# Altium schematic sheet BTL.SchDoc
size A; SheetNumber: 1; SheetTotal: 1
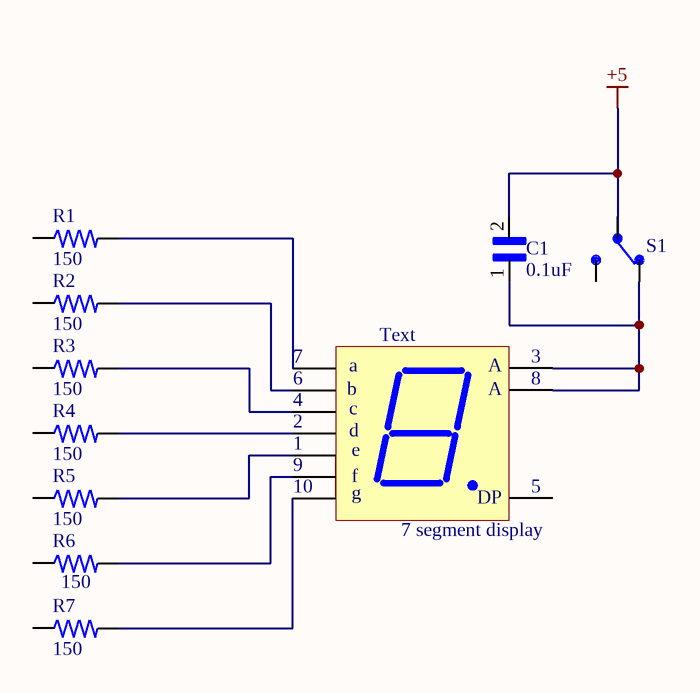
[diagram p0: BTL.SchDoc]

## Parts
?  (no value)  [DISPLAY_VDMG10A0]
C1  0.1uF  [CAPC1005X55N]
R1  150  [RESC2012X65N]
R2  150  [RESC2012X65N]
R3  150  [RESC2012X65N]
R4  150  [RESC2012X65N]
R5  150  [RESC2012X65N]
R6  150  [RESC2012X65N]
R7  150  [RESC2012X65N]
S1  JS102011JCQN  [SW_JS102011JCQN]  (value not drawn)

## Nets
+5: C1.2 S1.2
NetC1_1: C1.1 S1.1

Not connected (* = marked no-connect by the designer): ? ?1 ?2 ?3 ?4 ?5 ?6 ?7 ?8 ?9 ?10; R1 1 2; R2 1 2; R3 1 2; R4 1 2; R5 1 2; R6 1 2; R7 1 2; S1 3

## Notes on the sheet
- Text
- (in symbol Led 7S SMD) 7; 3; a; A; 6; 8; b; 4; c; 2; d; e; 9; f; 5; g; DP; 7 segment display

## Library data of the parts
? = Led 7S SMD: VDMG10 Series Green 7-Segment 572 nm SMT Display 10 mm Common Anode; Manufacturer: Vishay Semiconductors; Manufacturer Part Number: VDMG10A0; Wavelength: 572nm; Forward Current: 20mA; Forward Voltage: 2V; Power Consumption: 70mW; Number of Characters: 1; Luminous Intensity: 0.4mcd; Viewing Area (height): 10mm; Supplier 1: Digi-Key; RoHS: Yes; Category: LED Displays; Pricing 1: 1=1.55000, 10=1.38200, 100=1.07760 (USD); Case/Package: SMD/SMT; Number of Pins: 10; Color: Green; Min Operating Temperature: -35°C; Max Operating Temperature: 105°C; Illumination Color: Green; Element Configuration: Common Anode; Packaging: Tape and Reel; Package Quantity: 1; Max Power Dissipation: 70mW; Test Current: 20mA; Dominant Wavelength: 572nm; Width: 0.386inch; Height: 0.512inch; Radiation Hardening: No; REACH SVHC: Unknown; Lead Free: Lead Free; RoHS Compliant: Yes; ComponentLink1URL: https://datasheet.ciiva.com/23867/vdmx10x0-23867376.pdf?src-supplier=Newark; ComponentLink1Description: https://datasheet.ciiva.com/23867/vdmx10x0-23867376.pdf?src-supplier=Newark; ComponentLink2URL: https://datasheet.ciiva.com/24075/vdmx10x0-272413-24075313.pdf?src-supplier=Mouser; ComponentLink2Description: https://datasheet.ciiva.com/24075/vdmx10x0-272413-24075313.pdf?src-supplier=Mouser; ComponentLink3URL: https://datasheet.ciiva.com/23867/1809851-23867367.pdf?src-supplier=Newark; ComponentLink3Description: https://datasheet.ciiva.com/23867/1809851-23867367.pdf?src-supplier=Newark; ComponentLink4URL: https://datasheet.ciiva.com/29566/vdmx10x0-29566054.pdf?src-supplier=Digi-Key; ComponentLink4Description: https://datasheet.ciiva.com/29566/vdmx10x0-29566054.pdf?src-supplier=Digi-Key; ComponentLink5URL: https://datasheet.ciiva.com/29566/vdmx10x0-29566055.pdf?src-supplier=Digi-Key; ComponentLink5Description: https://datasheet.ciiva.com/29566/vdmx10x0-29566055.pdf?src-supplier=Digi-Key; ComponentLink6URL: https://datasheet.ciiva.com/24208/vdmx10x0-24208888.pdf?src-supplier=Future+Electronics; ComponentLink6Description: https://datasheet.ciiva.com/24208/vdmx10x0-24208888.pdf?src-supplier=Future+Electronics; ComponentLink7URL: https://datasheet.ciiva.com/29566/vdmx10x0-29566056.pdf?src-supplier=Digi-Key; ComponentLink7Description: https://datasheet.ciiva.com/29566/vdmx10x0-29566056.pdf?src-supplier=Digi-Key; ComponentLink8URL: https://datasheet.ciiva.com/30017/vdmx10x0-30017276.pdf?src-supplier=Avnet; ComponentLink8Description: https://datasheet.ciiva.com/30017/vdmx10x0-30017276.pdf?src-supplier=Avnet; ComponentLink9URL: https://datasheet.ciiva.com/22726/1913356-22726255.pdf?src-supplier=Element14; ComponentLink9Description: https://datasheet.ciiva.com/22726/1913356-22726255.pdf?src-supplier=Element14; Supplier Part Number 1: VDMG10A0DKR-ND
C1 = C0402C103K8RALTU: Cap Ceramic 0.01uF 10V X7R 10% SMD 0402 Paper T/R; Package: None; Price: None; Value: *; MP: C0402C103K8RALTU; Availability: Unavailable
R1-R7 = 1676221-2: RES SMD 1K OHM 0.1% 1/10W 0805; MF: TE Connectivity; Power_Rating: .1 W; Tolerance: .1%; Voltage_Rating: 100 V; Package: 0805; EU_RoHS_Compliance: Compliant; Value: *; TE_purchase_URL: https://www.te.com/usa-en/product-1676221-2.html?te_bu=Cor&te_type=disp&te_campaign=seda_glo_cor-seda-global-disp-prtnr-fy19-seda-model-bom-cta_sma-317_1&elqCampaignId=32493; Resistance: 1K; Price: None; MP: 1676221-2; Availability: Unavailable; SnapEDA_Link: https://www.snapeda.com/parts/1676221-2/TE%20Connectivity/view-part/2211096/?ref=snap
S1 = JS102011JCQN: Slide Switch SPDT Surface Mount; MF: C&K; Package: None; Price: None; Availability: Unavailable; MP: JS102011JCQN; SnapEDA_Link: https://www.snapeda.com/parts/JS102011JCQN/C%26K/view-part/595990/?ref=snap; Value: *